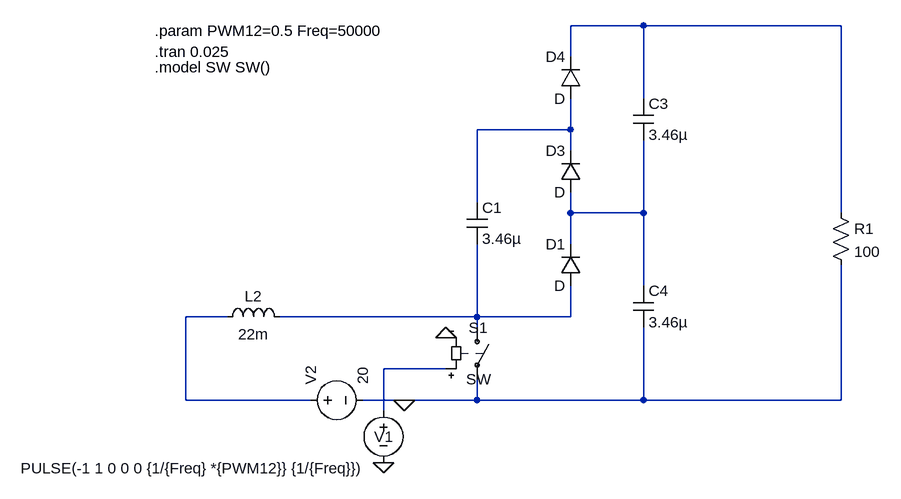
[diagram p0: schematic 1Nxsingle.asc]
1Nxsingle.asc, the LTspice schematic file:
Version 4
SHEET 1 1520 1864
WIRE 704 400 592 400
WIRE 1008 400 704 400
WIRE 592 448 592 400
WIRE 704 512 704 400
WIRE 592 560 592 512
WIRE 592 560 448 560
WIRE 592 592 592 560
WIRE 448 672 448 560
WIRE 592 688 592 656
WIRE 704 688 704 576
WIRE 704 688 592 688
WIRE 1008 688 1008 400
WIRE 592 736 592 688
WIRE 704 800 704 688
WIRE 64 848 0 848
WIRE 448 848 448 736
WIRE 448 848 144 848
WIRE 592 848 592 800
WIRE 592 848 448 848
WIRE 448 864 448 848
WIRE 400 928 304 928
WIRE 0 976 0 848
WIRE 192 976 0 976
WIRE 336 976 272 976
WIRE 448 976 448 944
WIRE 448 976 336 976
WIRE 704 976 704 864
WIRE 704 976 448 976
WIRE 1008 976 1008 768
WIRE 1008 976 704 976
WIRE 304 992 304 928
FLAG 400 880 0
FLAG 336 976 0
FLAG 304 1072 0
SYMBOL voltage 176 976 R270
WINDOW 123 0 0 Left 2
WINDOW 39 0 0 Left 2
SYMATTR InstName V2
SYMATTR Value 20
SYMBOL sw 448 848 R0
WINDOW 0 -13 17 Left 2
WINDOW 3 -17 96 Left 2
SYMATTR InstName S1
SYMBOL ind 48 864 R270
WINDOW 0 32 56 VTop 2
WINDOW 3 5 56 VBottom 2
SYMATTR InstName L2
SYMATTR Value 22m
SYMBOL cap 432 672 R0
SYMATTR InstName C1
SYMATTR Value 3.46µ
SYMBOL cap 688 800 R0
SYMATTR InstName C4
SYMATTR Value 3.46µ
SYMBOL diode 608 800 R180
WINDOW 0 24 64 Left 2
WINDOW 3 24 0 Left 2
SYMATTR InstName D1
SYMBOL diode 608 656 R180
WINDOW 0 24 64 Left 2
WINDOW 3 24 0 Left 2
SYMATTR InstName D3
SYMBOL diode 608 512 R180
WINDOW 0 24 64 Left 2
WINDOW 3 24 0 Left 2
SYMATTR InstName D4
SYMBOL cap 688 512 R0
SYMATTR InstName C3
SYMATTR Value 3.46µ
SYMBOL res 992 672 R0
SYMATTR InstName R1
SYMATTR Value 100
SYMBOL voltage 304 976 R0
WINDOW 3 -558 105 Left 2
WINDOW 123 0 0 Left 2
WINDOW 39 0 0 Left 2
WINDOW 0 -14 56 Left 2
SYMATTR Value PULSE(-1 1 0 0 0 {1/{Freq} *{PWM12}} {1/{Freq}})
SYMATTR InstName V1
TEXT -48 440 Left 2 !.tran 0.025
TEXT -48 464 Left 2 !.model SW SW()
TEXT -48 408 Left 2 !.param PWM12=0.5 Freq=50000

The netlist it stands for:
* 1Nxsingle.asc
V2 N004 0 20
S1 N005 0 N006 0 SW
L2 N004 N005 22m
C1 N002 N005 3.46µ
C4 N003 0 3.46µ
D1 N005 N003 D
D3 N003 N002 D
D4 N002 N001 D
C3 N001 N003 3.46µ
R1 N001 0 100
V1 N006 0 PULSE(-1 1 0 0 0 {1/{Freq} *{PWM12}} {1/{Freq}})
.model D D
.lib standard.dio
.tran 0.025
.model SW SW()
.param PWM12=0.5 Freq=50000
.backanno
.end